# Altium project HVSUP_module_1.5k_rev2.1.PrjPcb (part 1 of 2)
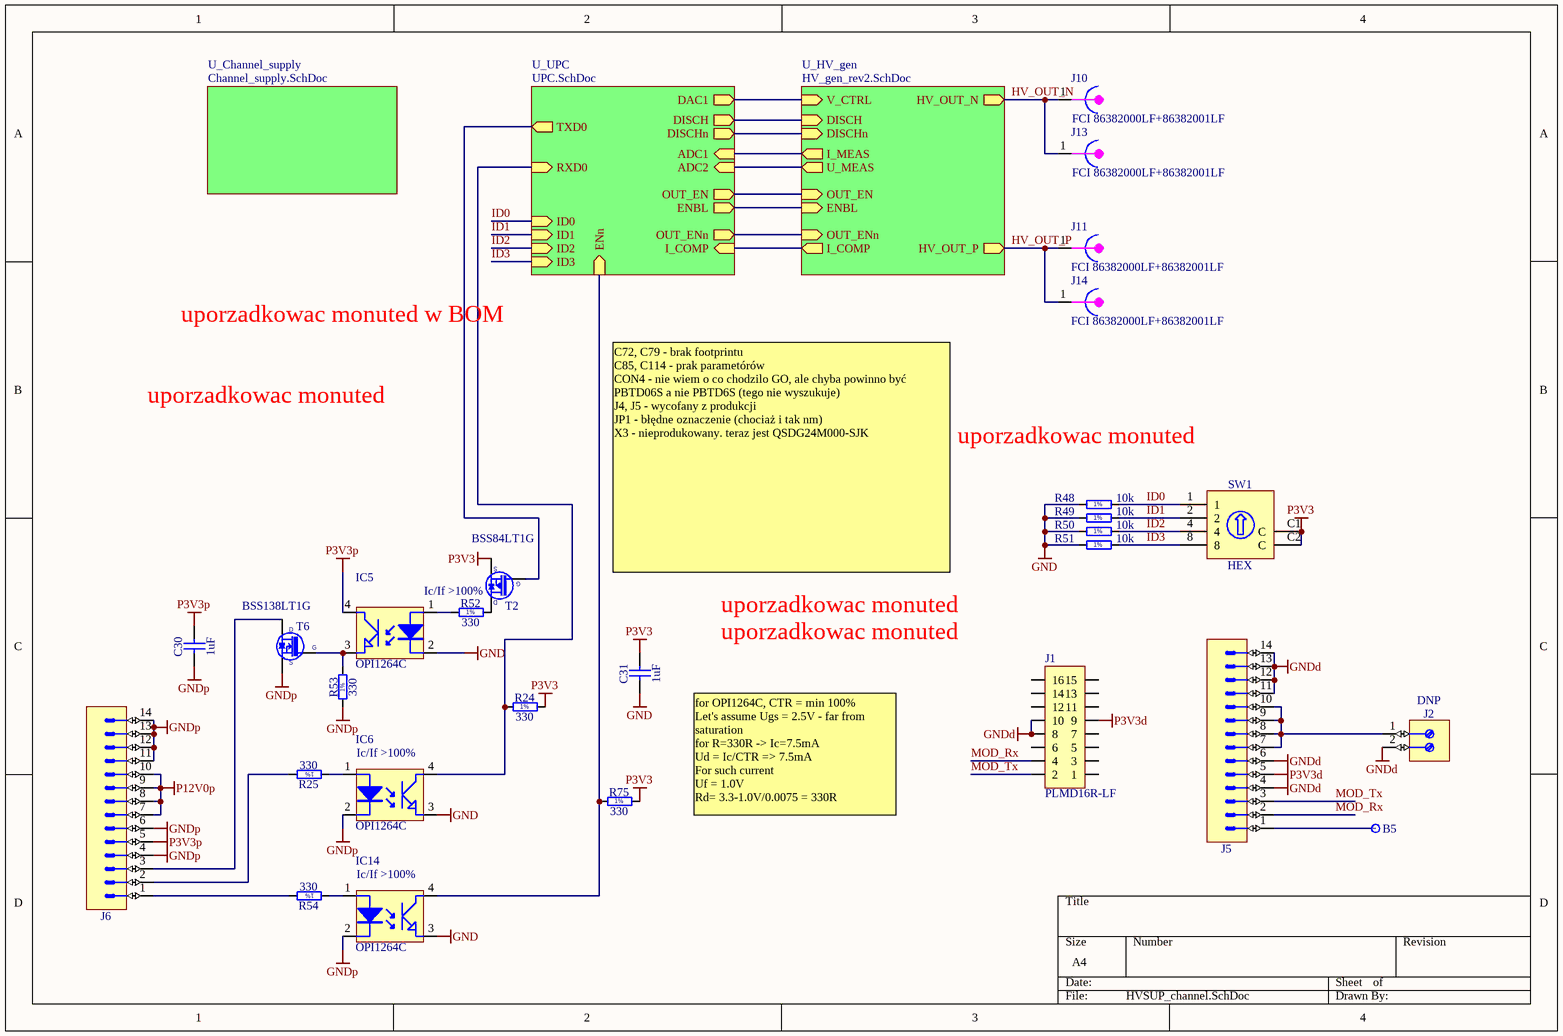
[diagram p0: HVSUP_channel.SchDoc]
4 sheets, 216 parts. Net scope: hierarchical (ports join the sheet entries above them; power ports are global).
Board file: HVSUP_channel_LLC_rev2.1.PcbDoc
Sheets:
  HVSUP_channel.SchDoc
    U_Channel_supply = Channel_supply.SchDoc
    U_UPC = UPC.SchDoc
    U_HV_gen = HV_gen_rev2.SchDoc

## Sheet HVSUP_channel.SchDoc
size A4

### Parts
B5  Plated Hole  [c130h80]  (value not drawn)
C30  1uF  [CAPC1005X55N]
C31  1uF  [CAPC1005X55N]
IC5  OPI1264C  [OPI1264C]
IC6  OPI1264C  [OPI1264C]
IC14  OPI1264C  [OPI1264C]
J1  PLMD16R-LF  [PLMD16R-LF]
J2  DNP  [PHOENIX_1725656]
J5  Header 14  [3M_N2514-5002RB]  (value not drawn)
J6  Header 14  [3M_N2514-5002RB]  (value not drawn)
J10  FCI 86382000LF+86382001LF  [FCI_86382000LF]
J11  FCI 86382000LF+86382001LF  [FCI_86382000LF]
J13  FCI 86382000LF+86382001LF  [FCI_86382000LF]
J14  FCI 86382000LF+86382001LF  [FCI_86382000LF]
R24  330  [RESC1005X40N]
R25  330  [RESC1005X40N]
R48  10k  [RESC1005X40N]
R49  10k  [RESC1005X40N]
R50  10k  [RESC1005X40N]
R51  10k  [RESC1005X40N]
R52  330  [RESC1005X40N]
R53  330  [RESC1005X40N]
R54  330  [RESC1005X40N]
R75  330  [RESC1005X40N]
SW1  HEX  [SW_OMRON_A6RV-162RF]
T2  BSS84LT1G  [SOT95P240X110-3N]
T6  BSS138LT1G  [SOT95P240X110-3N]

### Sub-sheets
U_Channel_supply = Channel_supply.SchDoc: no entries
U_HV_gen = HV_gen_rev2.SchDoc: HV_OUT_P (out), HV_OUT_N (out), ENBL (in), V_CTRL (in), I_MEAS (out), U_MEAS (out), OUT_EN (in), OUT_ENn (in), I_COMP (out), DISCH (in), DISCHn (in)
U_UPC = UPC.SchDoc: ADC1 (in), ADC2 (in), DAC1 (out), TXD0 (out), RXD0 (in), ENBL (out), ID0 (in), ID1 (in), ID2 (in), ID3 (in), OUT_EN (out), ENn (in), OUT_ENn (out), I_COMP (in), DISCH (out), DISCHn (out)

### Nets
GND: C31.1 IC5.2(K) IC6.3(E) IC14.3(E) R48.1 R49.1 R50.1 R51.1
GNDd: J1.8 J1.10 J2.2 J5.4 J5.6 J5.11 J5.12 J5.13 J5.14
GNDp: C30.1 IC6.2(K) IC14.2(K) J6.4 J6.6 J6.11 J6.12 J6.13 J6.14 R53.1 T6.2(S)
P3V3: C31.2 R24.2 R75.2 SW1.C1(C) SW1.C2(C) T2.2(S)
P3V3d: J1.9 J5.5
P3V3p: C30.2 IC5.4(C) J6.5
P12V0p: J6.7 J6.8 J6.9 J6.10
ADC1: sheet U_UPC/ADC1, sheet U_HV_gen/I_MEAS
ADC2: sheet U_UPC/ADC2, sheet U_HV_gen/U_MEAS
DAC1: sheet U_UPC/DAC1, sheet U_HV_gen/V_CTRL
HV_OUT_N: J10.1 J13.1 ; sheet U_HV_gen/HV_OUT_N
HV_OUT_P: J11.1 J14.1 ; sheet U_HV_gen/HV_OUT_P
ID0: R48.2 SW1.1 ; sheet U_UPC/ID0
ID1: R49.2 SW1.2 ; sheet U_UPC/ID1
ID2: R50.2 SW1.4 ; sheet U_UPC/ID2
ID3: R51.2 SW1.8 ; sheet U_UPC/ID3
MOD_Rx: J1.4 J5.2
MOD_Tx: J1.2 J5.3
RXD0: IC6.4(C) R24.1 ; sheet U_UPC/RXD0
TXD0: T2.1(G) ; sheet U_UPC/TXD0
Net1_1: sheet U_UPC/OUT_EN, sheet U_HV_gen/OUT_EN
NetB5_1: B5.1 J5.1
NetC71_1: sheet U_UPC/I_COMP, sheet U_HV_gen/I_COMP
NetIC5_1: IC5.1(A) R52.1
NetIC5_3: IC5.3(E) R53.2 T6.1(G)
NetIC6_1: IC6.1(A) R25.1
NetIC10_2: sheet U_UPC/OUT_ENn, sheet U_HV_gen/OUT_ENn
NetIC14_1: IC14.1(A) R54.1
NetIC14_4: IC14.4(C) R75.1 ; sheet U_UPC/ENn
NetIC15_7: sheet U_UPC/ENBL, sheet U_HV_gen/ENBL
NetIC15_20: sheet U_UPC/DISCH, sheet U_HV_gen/DISCH
NetIC15_21: sheet U_UPC/DISCHn, sheet U_HV_gen/DISCHn
NetJ2_1: J2.1 J5.7 J5.8 J5.9 J5.10
NetJ6_1: J6.1 R54.2
NetJ6_2: J6.2 R25.2
NetJ6_3: J6.3 T6.3(D)
NetR52_2: R52.2 T2.3(D)

Not connected (* = marked no-connect by the designer): J1 1 3 5 6 7 11 12 13 14 15 16

### Notes on the sheet
- uporzadkowac monuted w BOM
- uporzadkowac monuted
- C72, C79 - brak footprintu
  C85, C114 - prak parametórów
  CON4 - nie wiem o co chodzilo GO, ale chyba powinno być PBTD06S a nie PBTD6S (tego nie wyszukuje)
  J4, J5 - wycofany z produkcji
  JP1 - błędne oznaczenie (chociaż i tak nm)
  X3 - nieprodukowany. teraz jest QSDG24M000-SJK
- for OPI1264C, CTR = min 100%
  Let's assume Ugs = 2.5V - far from saturation
  for R=330R -> Ic=7.5mA
  Ud = Ic/CTR => 7.5mA
  For such current
  Uf = 1.0V
  Rd= 3.3-1.0V/0.0075 = 330R
- (in symbol OPTO-OPI1264C) Ic/If >100%
- (in symbol R0402_10K_1%_0.0625W_100PPM) 1%
- (in symbol R0402_330R_1%_0.0625W_100PPM) 1%

### Library data of the parts
B5 = PLATED_HOLE0.8_PAD1.3: Single Terminal Socket; Part Description: Plated Through Hole: Hole Dia.=0.8mm Pad Dia.=1.3mm; Mounted: No; Part Number: PLATED_HOLE0.8_PAD1.3; Component Kind: Standard (No BOM); Component Type: Standard (No BOM); Pin Count: 1; Family: Plated Hole; Socket: No; SMD: No; Sense: No; Status: None; ComponentHeight: 0mm; HelpURL: Undefined; Author: CERN DEM JLC; CreateDate: 2008-10-30; LatestRevisionDate: 2008-10-30; PackageDescription: Plated Through Hole: Hole Dia.=0.8mm Pad Dia.=1.3mm
C30 C31 = CC0402_1UF_16V_10%_X5R: Non-polarised capacitor; Part Description: SMD Multilayer Chip Ceramic Capacitor; Manufacturer: GENERIC; Manufacturer1 Part Number: C1005X5R1C105KT; Voltage: 16V; TC: X5R; Tolerance: ±10%; Part Number: CC0402_1UF_16V_10%_X5R; Component Kind: Standard; Component Type: Standard; Pin Count: 2; Value: 1uF; Status: Preferred; Manufacturer Part Number: CC0402_1UF_16V_10%_X5R; Case: 0402; Mounted: Yes; Socket: No; SMD: Yes; Sense: No; Manufacturer1 Example: TDK; Manufacturer1 ComponentHeight: 0.55mm; HelpURL: \\cern.ch\dfs\Applications\Altium\Datasheets\CC0402_X5R_TDK_C.pdf; Author: CERN DEM JLC; CreateDate: 2012-10-25; LatestRevisionDate: 2012-10-25
IC5 IC6 IC14 = OPTO-OPI1264C: 10kV opto-coupler; Supplier 1: Newark; Supplier Part Number 1: 08F2863
J1 = CON_2x8 2mm_RA_male: 2mm  dual row goldpin (Maritex)
J2 = PHOENIX_1725656: Terminal Block, 2 Positions, Screw Connection; Part Description: 6A, 63V, Terminal Block, Pitch 2.54mm, 2 Positions, Screw Connection; Manufacturer: PHOENIX CONTACT; Manufacturer Part Number: 1725656 (MPT 0,5/2-2,54); PressFit: No; Part Number: PHOENIX_1725656; Component Kind: Standard; Component Type: Standard; Pin Count: 2; Mounted: Yes; Socket: No; SMD: No; Sense: No; Status: None; ComponentHeight: 8.5mm; HelpURL: \\cern.ch\dfs\Applications\Altium\Datasheets\PHOENIX_1725656.pdf; Author: CERN DEM JMW; CreateDate: 2008-11-07; LatestRevisionDate: 2010-04-26
J5 J6 = 3M_N2514-5002RB: Connector 14 Male; Part Description: 14 Contacts - Right Angle .100" x .100" Low Profile Four-Wall Header, 2500 Series; Manufacturer: 3M; PressFit: No; Part Number: 3M_N2514-5002RB; Component Kind: Standard; Component Type: Standard; Pin Count: 14; Family: Header 14; Mounted: Yes; Socket: No; SMD: No; Sense: No; Status: None; Manufacturer Part Number: N2514-5002RB; ComponentHeight: 8.59mm; HelpURL: \\cern.ch\dfs\Applications\Altium\Datasheets\3M_N2514-5002RB.pdf; Author: CERN DEM JLC; CreateDate: 2008-10-29; LatestRevisionDate: 2012-01-16
J10 J11 J13 J14 = CON_HV_DSUB_PIN: D-SUB HIGH VOLTAGE CONTACT PIN
R24 R25 R52-R54 R75 = R0402_330R_1%_0.0625W_100PPM: Resistor - 1%; Part Description: General Purpose Thick Film Chip Resistor; Manufacturer: GENERIC; Manufacturer1 Part Number: 232270673301L; TC: ±100ppm/°C; Part Number: R0402_330R_1%_0.0625W_100PPM; Component Kind: Standard; Component Type: Standard; Pin Count: 2; Value: 330; Status: Not recommended; Power: 0.0625W; Tolerance: ±1%; Manufacturer Part Number: R0402_330R_1%_0.0625W_100PPM; Case: 0402; Mounted: Yes; Sense: No; Socket: No; SMD: Yes; Manufacturer1 Example: YAGEO PHYCOMP; Manufacturer1 ComponentHeight: 0.4mm; HelpURL: \\cern.ch\dfs\Applications\Altium\Datasheets\R0402_Phycomp_RC0402.pdf; Author: CERN DEM JLC; CreateDate: 2007-12-03; LatestRevisionDate: 2012-10-17
R48-R51 = R0402_10K_1%_0.0625W_100PPM: Resistor - 1%; Part Description: General Purpose Thick Film Chip Resistor; Manufacturer: GENERIC; Manufacturer1 Part Number: 232270671003L; TC: ±100ppm/°C; Part Number: R0402_10K_1%_0.0625W_100PPM; Component Kind: Standard; Component Type: Standard; Pin Count: 2; Value: 10k; Status: Not recommended; Power: 0.0625W; Tolerance: ±1%; Manufacturer Part Number: R0402_10K_1%_0.0625W_100PPM; Case: 0402; Mounted: Yes; Sense: No; Socket: No; SMD: Yes; Manufacturer1 Example: YAGEO PHYCOMP; Manufacturer1 ComponentHeight: 0.4mm; HelpURL: \\cern.ch\dfs\Applications\Altium\Datasheets\R0402_Phycomp_RC0402.pdf; Author: CERN DEM JLC; CreateDate: 2007-12-03; LatestRevisionDate: 2012-10-17
SW1 = SW_OMRON_A6RV-162RF: Rotary Code Switch 1 2 4 8 C1 C2; Part Number: SW_OMRON_A6RV-162RF or ERD716RR; Part Description: Side Actuated, Hexadecimal Rotary Code Switch; Manufacturer: OMRON; Manufacturer Part Number: A6RV-162RF or ERD716RR; PressFit: No; Component Kind: Standard; Component Type: Standard; Pin Count: 6; PackageDescription: Body 9.8x6.64mm, Side Actuated, Rotary Code Switch, OMRON A6RV Series; Family: HEX; Mounted: Yes; Socket: No; SMD: No; Sense: No; Status: None; ComponentHeight: 9.9mm; HelpURL: \\cern.ch\dfs\Applications\Altium\Datasheets\SW_OMRON_A6RV.pdf; Author: CERN DEM JLC; CreateDate: 2008-11-27; LatestRevisionDate: 2011-01-19
T2 = BSS84LT1G: P-CHANNEL MOSFET WITH DIODE; Part Description: 50V 130mA Single P-Channel Power MOSFET; Manufacturer: ON SEMICONDUCTOR; PressFit: No; Bonding: No; Part Number: BSS84LT1G; Component Kind: Standard; Component Type: Standard; Device: BSS84LT1G; PackageDescription: SOT23 3-Leads, Pitch 0.95mm - Body 1.4x3mm, IPC Medium Density; Manufacturer Part Number: BSS84LT1G; Pin Count: 3; Case: SOT23-3; Mounted: Yes; Socket: No; SMD: Yes; Sense: No; ComponentHeight: 1.1mm; HelpURL: \\cern.ch\dfs\Applications\Altium\Datasheets\BSS84LT1G.pdf; Author: CERN DEM JLC; CreateDate: 2012-03-29; LatestRevisionDate: 2012-03-29
T6 = BSS138LT1G: N-CHANNEL MOSFET WITH DIODE; Part Description: 50V 200mA N-Channel Enhancement Mode Field-Effect Transistor; Manufacturer: ON SEMICONDUCTOR; PressFit: No; Bonding: No; Part Number: BSS138LT1G; Component Kind: Standard; Component Type: Standard; Device: BSS138LT1G; PackageDescription: SOT23 3-Leads, Pitch 0.95mm - Body 1.4x3mm, IPC Medium Density; Manufacturer Part Number: BSS138LT1G; Pin Count: 3; Case: SOT23-3; Mounted: Yes; Socket: No; SMD: Yes; Sense: No; ComponentHeight: 1.11mm; HelpURL: \\cern.ch\dfs\Applications\Altium\Datasheets\BSS138LT1G.pdf; Author: CERN DEM JLC; CreateDate: 2009-03-23; LatestRevisionDate: 2009-03-23

## Sheet Channel_supply.SchDoc
size A3
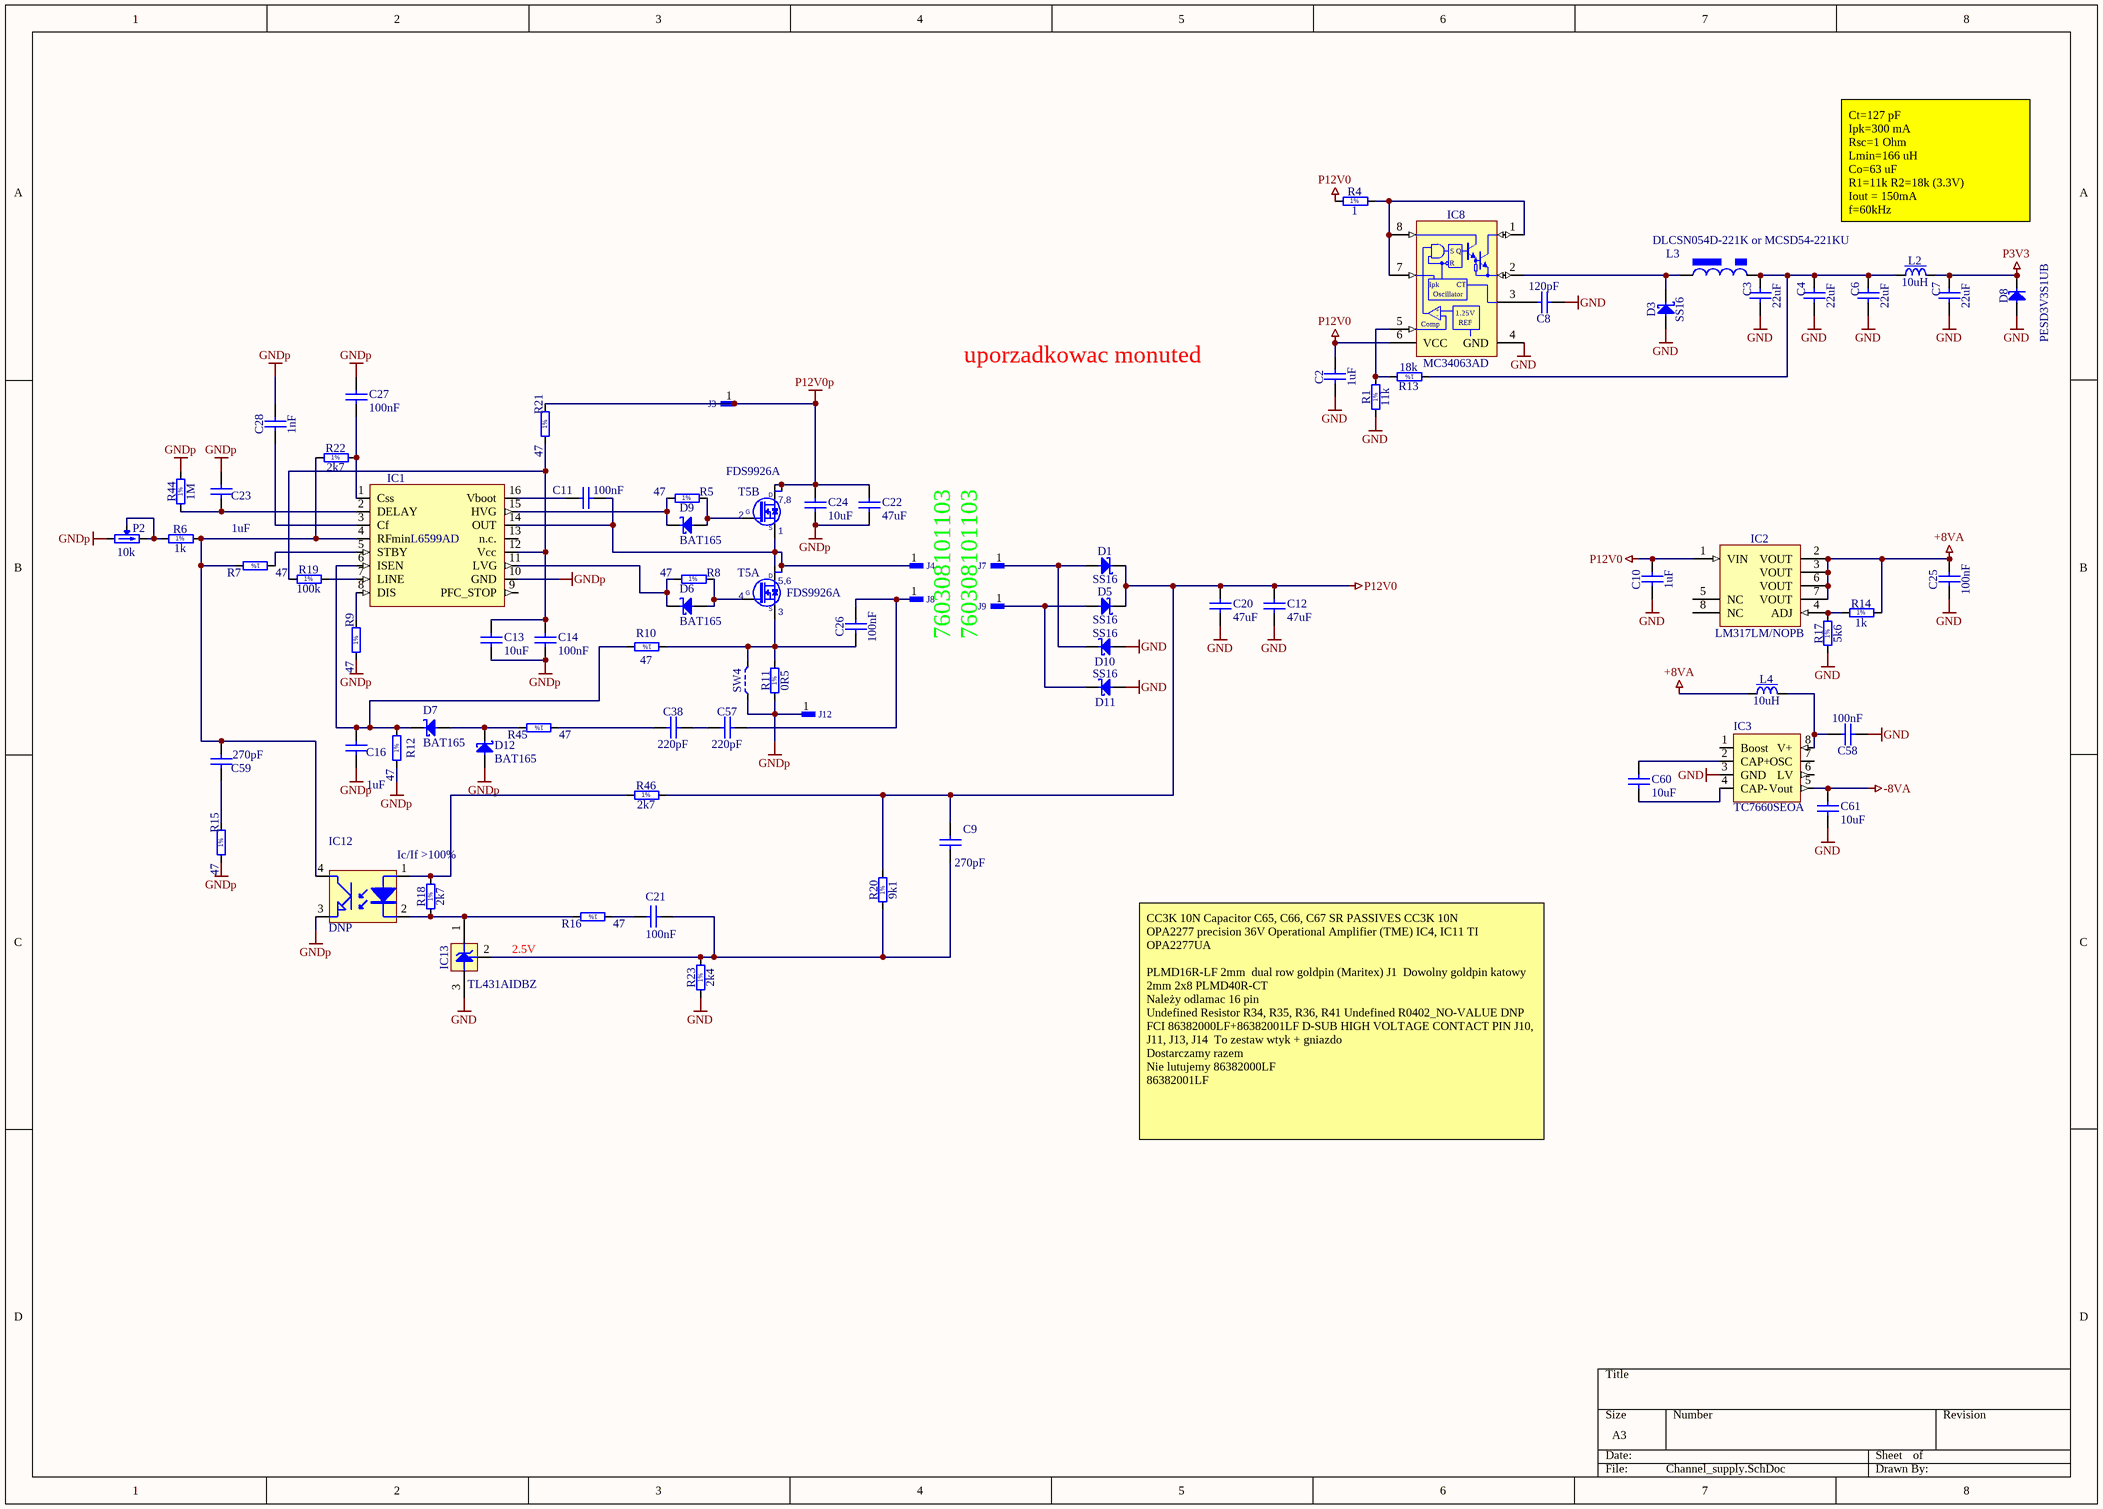
[diagram p1: Channel_supply.SchDoc]

### Parts
C2  1uF  [CAPC1608X87N]
C3  22uF  [CAPC2012X135N]
C4  22uF  [CAPC2012X135N]
C6  22uF  [CAPC2012X135N]
C7  22uF  [CAPC2012X135N]
C8  120pF  [CAPC1005X55N]
C9  270pF  [CAPC1608X87N]
C10  1uF  [CAPC1608X87N]
C11  100nF  [CAPC1005X55N]
C12  47uF  [CAPC3216X180N]
C13  10uF  [CAPC3216X180N]
C14  100nF  [CAPC1005X55N]
C16  1uF  [CAPC1608X87N]
C20  47uF  [CAPC3216X180N]
C21  100nF  [CAPC1005X55N]
C22  47uF  [CAPC3216X180N]
C23  1uF  [CAPC1608X87N]
C24  10uF  [CAPC3216X180N]
C25  100nF  [CAPC1005X55N]
C26  100nF  [CAPC4532X250N]
C27  100nF  [CAPC1005X55N]
C28  1nF  [CAPC1608X90N]
C38  220pF  [CAPC3216X140N]
C57  220pF  [CAPC3216X140N]
C58  100nF  [CAPC1005X55N]
C59  270pF  [CAPC1608X87N]
C60  10uF  [CAPC3216X180N]
C61  10uF  [CAPC3216X180N]
D1  SS16  [DIOM5127X229N]
D3  SS16  [DIOM5127X229N]
D5  SS16  [DIOM5127X229N]
D6  BAT165  [SOD2512X110N]
D7  BAT165  [SOD2512X110N]
D8  PESD3V3S1UB  [SODFL1608X65N]
D9  BAT165  [SOD2512X110N]
D10  SS16  [DIOM5127X229N]
D11  SS16  [DIOM5127X229N]
D12  BAT165  [SOD2512X110N]
IC1  L6599AD  [SOIC127P600X175-16N]
IC2  LM317LM/NOPB  [SOIC127P600X175-8N]
IC3  TC7660SEOA  [SO-8]
IC8  MC34063AD  [SOIC127P600X175-8N]
IC12  DNP  [OPI1264C]
IC13  TL431AIDBZ  [SOT95P237X112-3N]
J3  SMD Pad  [R400X300]  (value not drawn)  (no BOM)
J4  SMD Pad  [R400X300]  (value not drawn)  (no BOM)
J7  SMD Pad  [R400X300]  (value not drawn)  (no BOM)
J8  SMD Pad  [R400X300]  (value not drawn)  (no BOM)
J9  SMD Pad  [R400X300]  (value not drawn)  (no BOM)
J12  SMD Pad  [R400X300]  (value not drawn)  (no BOM)
L2  10uH  [INDM3225X210N]
L3  DLCSN054D-221K or MCSD54-221KU  [L_CSN054D]
L4  10uH  [INDM3225X210N]
P2  10k  [TRIM_BOURNS_3314G-1]
R1  11k  [RESC1005X40N]
R4  1  [RESC1608X55N]
R5  47  [RESC1608X55N]
R6  1k  [RESC1005X40N]
R7  47  [RESC1608X55N]
R8  47  [RESC1608X55N]
R9  47  [RESC1608X55N]
R10  47  [RESC1608X55N]
R11  0R5  [RESC6532X80N]
R12  47  [RESC1608X55N]
R13  18k  [RESC1005X40N]
R14  1k  [RESC1005X40N]
R15  47  [RESC1608X55N]
R16  47  [RESC1608X55N]
R17  5k6  [RESC1005X40N]
R18  2k7  [RESC1608X55N]
R19  100k  [RESC1005X40N]
R20  9k1  [RESC1608X55N]
R21  47  [RESC1608X55N]
R22  2k7  [RESC1608X55N]
R23  2k4  [RESC1608X55N]
R44  1M  [RESC1608X55N]
R45  47  [RESC1608X55N]
R46  2k7  [RESC1608X55N]
SW4  Switch  [JUMPSMD0805_G50]  (value not drawn)  (no BOM)
T5  FDS9926A  [SOIC127P600X175-8N]  (parts A,B of 2)

### Nets
+8VA: C25.2 IC2.2(VOUT) IC2.3(VOUT) IC2.6(VOUT) IC2.7(VOUT) L4.1 R14.2
-8VA: C61.1 IC3.5(Vout)
GND: C2.1 C3.1 C4.1 C6.1 C7.1 C8.1 C10.1 C12.2 C20.2 C25.1 C58.1 C61.2 D3.2(A) D8.2(A) D10.2(A) D11.2(A) IC3.3(GND) IC8.4(GND) IC13.3(A) R1.1 R17.1 R23.1
GNDp: C13.2 C14.2 C16.1 C22.2 C23.2 C24.2 C27.1 C28.2 D12.2(A) IC1.10(GND) IC12.3(E) J12.1 P2.1(CCW) R9.1 R11.1 R12.1 R15.1 R44.2 SW4.1
P3V3: C7.2 D8.1(C) L2.2
P12V0: C2.2 C9.2 C10.2 C12.1 C20.1 D1.1(C) D5.1(C) IC2.1(VIN) IC8.6(VCC) R4.1 R20.2 R46.2
P12V0p: C22.1 C24.1 J3.1 R21.2 T5.7(D) T5.8(D)
NetC3_2: C3.2 C4.2 C6.2 L2.1 L3.2 R13.1
NetC8_2: C8.2 IC8.3(TC)
NetC9_1: C9.1 C21.1 IC13.2(Adj) R20.1 R23.2
NetC11_1: C11.1 IC1.16(Vboot)
NetC11_2: C11.2 IC1.14(OUT) J4.1 T5.1(S) T5.5(D) T5.6(D)
NetC13_1: C13.1 C14.1 IC1.12(Vcc) R19.1 R21.1
NetC16_2: C16.2 D7.1(C) IC1.6(ISEN) R10.2 R12.2
NetC21_2: C21.2 R16.1
NetC23_1: C23.1 IC1.2(DELAY) R44.1
NetC26_1: C26.1 R10.1 R11.2 SW4.2 T5.3(S)
NetC26_2: C26.2 C57.2 J8.1
NetC27_2: C27.2 IC1.1(Css) R22.2
NetC28_1: C28.1 IC1.3(Cf)
NetC38_1: C38.1 R45.1
NetC38_2: C38.2 C57.1
NetC58_2: C58.2 IC3.8(V+) L4.2
NetC59_1: C59.1 R15.2
NetC59_2: C59.2 IC1.4(RFmin) IC12.4(C) R6.2 R7.2 R22.1
NetC60_1: C60.1 IC3.2(CAP+)
NetC60_2: C60.2 IC3.4(CAP-)
NetD1_2: D1.2(A) D10.1(C) J7.1
NetD3_1: D3.1(C) IC8.2(SWE) L3.1
NetD5_2: D5.2(A) D11.1(C) J9.1
NetD6_1: D6.1(C) IC1.11(LVG) R8.1
NetD6_2: D6.2(A) R8.2 T5.4(G)
NetD7_2: D7.2(A) D12.1(C) R45.2
NetD9_1: D9.1(C) IC1.15(HVG) R5.1
NetD9_2: D9.2(A) R5.2 T5.2(G)
NetIC1_5: IC1.5(STBY) R7.1
NetIC1_7: IC1.7(LINE) R19.2
NetIC1_8: IC1.8(DIS) R9.2
NetIC2_4: IC2.4(ADJ) R14.1 R17.2
NetIC8_1: IC8.1(SWC) IC8.7(Ipk) IC8.8(DRVC) R4.2
NetIC8_5: IC8.5(COMP) R1.2 R13.2
NetIC12_1: IC12.1(A) R18.2 R46.1
NetIC12_2: IC12.2(K) IC13.1(C) R16.2 R18.1
NetP2_2: P2.2(W) P2.3(CW) R6.1

Not connected (* = marked no-connect by the designer): IC1 9(PFC_STOP) 13(n.c.); IC2 5(NC) 8(NC); IC3 1(Boost) 6(LV) 7(OSC)

### Notes on the sheet
- Ct=127 pF
  Ipk=300 mA
  Rsc=1 Ohm
  Lmin=166 uH
  Co=63 uF
  R1=11k R2=18k (3.3V)
  Iout = 150mA
  f=60kHz
- uporzadkowac monuted
- 760308101103
- 2.5V
- CC3K 10N	Capacitor	C65, C66, C67	SR PASSIVES	CC3K 10N
  OPA2277	precision 36V Operational Amplifier (TME)	IC4, IC11	TI	OPA2277UA
  PLMD16R-LF	2mm  dual row goldpin (Maritex)	J1		Dowolny goldpin katowy 2mm 2x8	PLMD40R-CT
  Należy odlamac 16 pin
  Undefined	Resistor	R34, R35, R36, R41	Undefined	R0402_NO-VALUE	DNP
  FCI 86382000LF+86382001LF	D-SUB HIGH VOLTAGE CONTACT PIN	J10, J11, J13, J14		To zestaw wtyk + gniazdo
  Dostarczamy razem
  Nie lutujemy	86382000LF
  86382001LF
- (in symbol FDS9926A, part A) 5,6
- (in symbol FDS9926A, part B) 7,8
- (in symbol MC34063AD) S; Q; R; CT; Oscillator; +; -; 1.25V; Comp; REF
- (in symbol OPTO-OPI1264C) Ic/If >100%
- (in symbol R0402_1K_1%_0.0625W_100PPM) 1%
- (in symbol R0402_5K6_1%_0.0625W_100PPM) 1%
- (in symbol R0402_11K_1%_0.0625W_100PPM) 1%
- (in symbol R0402_18K_1%_0.0625W_100PPM) 1%
- (in symbol R0402_100K_1%_0.0625W_100PPM) 1%
- (in symbol R0603_1M_1%_0.1W_100PPM) 1%
- (in symbol R0603_1R_1%_0.1W_200PPM) 1%
- (in symbol R0603_2K4_1%_0.1W_100PPM) 1%
- (in symbol R0603_2K7_1%_0.1W_100PPM) 1%
- (in symbol R0603_9K1_1%_0.1W_100PPM) 1%
- (in symbol R0603_47R_1%_0.1W_100PPM) 1%
- (in symbol R2512_0R5_1%_1.5W_100PPM) 1%

### Library data of the parts
C2 C10 C16 C23 = CC0603_1UF_25V_10%_X7R: Non-polarised capacitor; Part Description: SMD Multilayer Chip Ceramic Capacitor; Manufacturer: GENERIC; Manufacturer1 Part Number: GRM188R71E105KA12D; Voltage: 25V; TC: X7R; Tolerance: ±10%; Part Number: CC0603_1UF_25V_10%_X7R; Component Kind: Standard; Component Type: Standard; Pin Count: 2; Value: 1uF; Status: None; Manufacturer Part Number: CC0603_1UF_25V_10%_X7R; Case: 0603; Mounted: Yes; Socket: No; SMD: Yes; Sense: No; Manufacturer1 Example: MURATA; Manufacturer1 ComponentHeight: 0.9mm; HelpURL: \\cern.ch\dfs\Applications\Altium\Datasheets\CC0603_X7R_MURATA.pdf; Author: CERN DEM JLC; CreateDate: 2011-01-18; LatestRevisionDate: 2011-01-18
C3 C4 C6 C7 = CC0805_22UF_10V_+80%-20%_Y5V: Non-polarised capacitor; Part Description: SMD Multilayer Chip Ceramic Capacitor; Manufacturer: GENERIC; Manufacturer1 Part Number: 2222 241 19881; Voltage: 10V; TC: Y5V; Part Number: CC0805_22UF_10V_+80%-20%_Y5V; Component Kind: Standard; Component Type: Standard; Pin Count: 2; Value: 22uF; Status: Preferred; Tolerance: +80% -20%; Manufacturer Part Number: CC0805_22UF_10V_+80%-20%_Y5V; Case: 0805; Mounted: Yes; Socket: No; SMD: Yes; Sense: No; Manufacturer1 Example: PHYCOMP; Manufacturer1 ComponentHeight: 1.45mm; HelpURL: \\cern.ch\dfs\Applications\Altium\Datasheets\CC0805_Y5V_PHYCOMP.pdf; Author: CERN DEM JLC; CreateDate: 2007-12-03; LatestRevisionDate: 2007-12-03
C8 = CC0402_120PF_50V_5%_C0G: Non-polarised capacitor; Part Description: SMD Multilayer Chip Ceramic Capacitor; Manufacturer: GENERIC; Manufacturer1 Part Number: C0402C121J5GACTU; Voltage: 50V; TC: C0G/NP0; Tolerance: ±5%; Part Number: CC0402_120PF_50V_5%_C0G; Component Kind: Standard; Component Type: Standard; Pin Count: 2; Value: 120pF; Status: Preferred; Manufacturer Part Number: CC0402_120PF_50V_5%_C0G; Case: 0402; Mounted: Yes; Socket: No; SMD: Yes; Sense: No; Manufacturer1 Example: KEMET; Manufacturer1 ComponentHeight: 0.55mm; HelpURL: \\cern.ch\dfs\Applications\Altium\Datasheets\CC0805_C0G_KEMET_(Commercial Grade).pdf; Author: CERN DEM JLC; CreateDate: 2011-11-10; LatestRevisionDate: 2015-04-22
C9 C59 = CC0603_270PF_50V_5%_NP0: Non-polarised capacitor; Part Description: SMD Multilayer Chip Ceramic Capacitor; Manufacturer: GENERIC; Manufacturer1 Part Number: 223886715271; Voltage: 50V; TC: C0G/NP0; Tolerance: ±5%; Part Number: CC0603_270PF_50V_5%_NP0; Component Kind: Standard; Component Type: Standard; Pin Count: 2; Value: 270pF; Status: Preferred; Manufacturer Part Number: CC0603_270PF_50V_5%_NP0; Case: 0603; Mounted: Yes; Socket: No; SMD: Yes; Sense: No; Manufacturer1 Example: PHYCOMP; Manufacturer1 ComponentHeight: 0.87mm; HelpURL: \\cern.ch\dfs\Applications\Altium\Datasheets\CC0603_NP0_PHYCOMP.pdf; Author: CERN DEM JLC; CreateDate: 2007-12-03; LatestRevisionDate: 2007-12-03
C11 C14 C21 C27 = CC0402_100NF_16V_10%_X7R: Non-polarised capacitor; Part Description: SMD Multilayer Chip Ceramic Capacitor; Manufacturer: GENERIC; Manufacturer1 Part Number: GRM155R71C104KA88D; Voltage: 16V; TC: X7R; Tolerance: ±10%; Table: Capacitors SMD; Part Number: CC0402_100NF_16V_10%_X7R; Component Kind: Standard; Component Type: Standard; Pin Count: 2; Value: 100nF; Status: Not Recommended; Manufacturer Part Number: CC0402_100NF_16V_10%_X7R; Case: 0402; Mounted: Yes; Socket: No; SMD: Yes; Manufacturer1 Example: MURATA; Manufacturer1 ComponentHeight: 0.55mm; HelpURL: \\cern.ch\dfs\Applications\Altium\Datasheets\CC0402_X7R_MURATA_GRM.pdf; Author: CERN DEM JLC; CreateDate: 2013-12-05; LatestRevisionDate: 2007-12-03
C12 C20 C22 = CC1206_47UF_25V_20%_X5R: Non-polarised capacitor; Part Description: SMD Multilayer Chip Ceramic Capacitor; Manufacturer: TDK; Manufacturer Part Number: C3216X5R1E476M160AC; Voltage: 25V; TC: X5R; Tolerance: ±20%; Table: Capacitors SMD; Part Number: CC1206_47UF_25V_20%_X5R; Component Kind: Standard; Component Type: Standard; Pin Count: 2; Value: 47uF; Status: None; Case: 1206; Mounted: Yes; Socket: No; SMD: Yes; HelpURL: \\cern.ch\dfs\Applications\Altium\Datasheets\CC1206_X5R_TDK_C.pdf; Author: CERN DEM JLC; CreateDate: 2013-11-20; LatestRevisionDate: 2013-11-20; ComponentHeight: 1.8mm
C13 C24 C60 C61 = CC1206_10UF_25V_10%_X7R: Non-polarised capacitor; Part Description: SMD Multilayer Chip Ceramic Capacitor; Manufacturer: GENERIC; Manufacturer1 Part Number: C1206C106K4RACTU; Voltage: 25V; TC: X7R; Tolerance: ±10%; Table: Capacitors SMD; Part Number: CC1206_10UF_25V_10%_X7R; Component Kind: Standard; Component Type: Standard; Pin Count: 2; Value: 10uF; Status: Preferred; Manufacturer Part Number: CC1206_10uF_25V_10%_X7R; Case: 1206; Mounted: Yes; Socket: No; SMD: Yes; Manufacturer1 Example: KEMET; Manufacturer1 ComponentHeight: 1.8mm; HelpURL: \\cern.ch\dfs\Applications\Altium\Datasheets\CC1206_X7R_KEMET.pdf; Author: CERN DEM JLC; CreateDate: 2012-09-12; LatestRevisionDate: 2012-09-12
C25 C58 = CC0402_100NF_16V_10%_X7R: Non-polarised capacitor; Part Description: SMD Multilayer Chip Ceramic Capacitor; Manufacturer: GENERIC; Manufacturer1 Part Number: GRM155R71C104KA88D; Voltage: 16V; TC: X7R; Tolerance: ±10%; Part Number: CC0402_100NF_16V_10%_X7R; Component Kind: Standard; Component Type: Standard; Pin Count: 2; Value: 100nF; Status: Not Recommended; Manufacturer Part Number: CC0402_100NF_16V_10%_X7R; Case: 0402; Mounted: Yes; Socket: No; SMD: Yes; Sense: No; Manufacturer1 Example: MURATA; Manufacturer1 ComponentHeight: 0.55mm; HelpURL: \\cern.ch\dfs\Applications\Altium\Datasheets\CC0402_X7R_MURATA_GRM.pdf; Author: CERN DEM JLC; CreateDate: 2013-12-05; LatestRevisionDate: 2007-12-03
C26 = CC1812_100NF_500V_10%_X7R: Non-polarised capacitor; Part Description: SMD Multilayer Chip Ceramic Capacitor; Manufacturer: GENERIC; Manufacturer1 Part Number: 1812Y5000104KXB; Voltage: 500V; TC: X7R; Tolerance: ±10%; Part Number: CC1812_100NF_500V_10%_X7R; Component Kind: Standard; Component Type: Standard; Pin Count: 2; Value: 100nF; Status: None; Manufacturer Part Number: CC1812_100NF_500V_10%_X7R; Case: 1812; Mounted: Yes; Socket: No; SMD: Yes; Sense: No; Manufacturer1 Example: SYFER; Manufacturer1 ComponentHeight: 2.5mm; HelpURL: \\cern.ch\dfs\Applications\Altium\Datasheets\CC1812_X7R_SYFER.pdf; Author: CERN DEM JMW; CreateDate: 2009-01-23; LatestRevisionDate: 2011-06-07
C28 = CC0603_1NF_50V_5%_NP0: Non-polarised capacitor; Part Description: SMD Multilayer Chip Ceramic Capacitor; Manufacturer: GENERIC; Manufacturer1 Part Number: CC0603JRNPO9BN102; Voltage: 50V; TC: C0G/NP0; Tolerance: ±5%; Part Number: CC0603_1NF_50V_5%_NP0; Component Kind: Standard; Component Type: Standard; Pin Count: 2; Value: 1nF; Status: Preferred; Manufacturer Part Number: CC0603_1NF_50V_5%_NP0; Case: 0603; Mounted: Yes; Socket: No; SMD: Yes; Sense: No; Manufacturer1 Example: YAGEO PHYCOMP; Manufacturer1 ComponentHeight: 0.9mm; HelpURL: \\cern.ch\dfs\Applications\Altium\Datasheets\CC0805_NP0_PHYCOMP_16VTO50V.pdf; Author: CERN DEM JLC; CreateDate: 22.10.2012; LatestRevisionDate: 22.10.2012
C38 C57 = CC1206_220PF_100V_5%_NP0: Non-polarised capacitor; Part Description: SMD Multilayer Chip Ceramic Capacitor; Manufacturer: GENERIC; Manufacturer1 Part Number: 12061A221JAT2A; Voltage: 100V; TC: C0G/NP0; Tolerance: ±5%; Part Number: CC1206_220PF_100V_5%_NP0; Component Kind: Standard; Component Type: Standard; Pin Count: 2; Value: 220pF; Status: Preferred; Manufacturer Part Number: CC1206_220PF_100V_5%_NP0; Case: 1206; Mounted: Yes; Socket: No; SMD: Yes; Sense: No; Manufacturer1 Example: AVX; Manufacturer1 ComponentHeight: 0.94mm; HelpURL: \\cern.ch\dfs\Applications\Altium\Datasheets\CC1206_NP0_AVX.pdf; Author: CERN DEM JLC; CreateDate: 06.04.2011; LatestRevisionDate: 06.04.2011
D1 D3 D5 D10 D11 = SS16: Schottky Diode; Part Description: Surface Mount Schottky Barrier Rectifier; Manufacturer: VISHAY GENERAL SEMICONDUCTOR; Voltage: 60V; Power: 1A; PressFit: No; Bonding: No; Part Number: SS16; Component Kind: Standard; Component Type: Standard; Device: SS16; PackageDescription: DO-214-AC Molded Diode, Body 5.1x2.7mm, IPC Medium Density; Manufacturer Part Number: SS16; Pin Count: 2; Case: DO-214AC; Mounted: Yes; Socket: No; SMD: Yes; Sense: No; ComponentHeight: 2.29mm; HelpURL: \\cern.ch\dfs\Applications\Altium\Datasheets\SS16.pdf; Author: CERN DEM JLC; CreateDate: 2008-07-15; LatestRevisionDate: 2010-08-23
D6 D7 D9 D12 = BAT165: Schottky Diode; Part Description: Medium Power AF Schottky Diode; Manufacturer: INFINEON; Voltage: 40V; Power: 750mA; Mounted: No; PressFit: No; Bonding: No; Table: Diodes; Part Number: BAT165; Component Kind: Standard; Component Type: Standard; Device: BAT165; PackageDescription: Small Outline Diode Flat Lead (SOD-323), 1.70mm W X 1.25mm L X 1.10mm H body,  IPC Medium Density; Manufacturer Part Number: BAT165; Pin Count: 2; Case: SOD323; Socket: No; SMD: Yes; ComponentHeight: 1.1mm; HelpURL: \\cern.ch\dfs\Applications\Altium\Datasheets\BAT165.pdf; Author: CERN DEM JLC; CreateDate: 2014-11-12; LatestRevisionDate: 2014-11-12
D8 = PESD3V3S1UB: ESD protection diode; Part Description: ESD protection diode (23kV); Manufacturer: NXP SEMICONDUCTORS; Voltage: 3V3; Power: 330W; PressFit: No; Bonding: No; Part Number: PESD3V3S1UB; Component Kind: Standard; Component Type: Standard; Device: PESD3V3S1UB; PackageDescription: Ultra Small Outline Diode Flat Lead (SOD-523), Body; 1.2mm L X 0.8mm W X 0.65mm H, IPC Medium Density; Manufacturer Part Number: PESD3V3S1UB; Pin Count: 2; Case: SOD523; Mounted: Yes; Socket: No; SMD: Yes; Sense: No; ComponentHeight: 0.65mm; HelpURL: \\cern.ch\dfs\Applications\Altium\Datasheets\PESD3V3S1UB.pdf; Author: CERN DEM JLC; CreateDate: 2012-11-29; LatestRevisionDate: 2012-11-29
IC1 = PM_L6599: Improved high voltage resonant LLC controller; Part Description: Improved high voltage resonant controller; Manufacturer: ST MICROELECTRONICS; PressFit: No; Bonding: No; Part Number: L6599AD; Component Kind: Standard; Component Type: Standard; Device: L6599AD; PackageDescription: SOIC 16, Pitch 1.27mm - Body 4x10mm, IPC Medium Density; Manufacturer Part Number: L6599AD; Pin Count: 16; Case: SO-16; Mounted: Yes; Socket: No; SMD: Yes; Sense: No; ComponentHeight: 1.75mm; Author: GK; CreateDate: 2016-05-23; LatestRevisionDate: 2016-05-23
IC2 = LM317LM/NOPB: 1.2V to 37V, 100mA Adjustable Positive Regulator; Part Description: 1.2V to 37V, 100mA Adjustable Positive Voltage Regulator; Manufacturer: TEXAS INSTRUMENTS; PressFit: No; Bonding: No; Part Number: LM317LM/NOPB; Component Kind: Standard; Component Type: Standard; Device: LM317LM/NOPB; PackageDescription: SOIC 8, Pitch 1.27mm - Body 4x5mm, IPC Medium Density; Manufacturer Part Number: LM317LM/NOPB; Pin Count: 8; Case: SOIC8; Mounted: Yes; Socket: No; SMD: Yes; Sense: No; ComponentHeight: 1.75mm; HelpURL: \\cern.ch\dfs\Applications\Altium\Datasheets\LM317LM-NOPB.pdf; Author: CERN DEM JLC; CreateDate: 2012-04-12; LatestRevisionDate: 2014-09-16
IC3 = PM_TC7660: 20mA PUMP DC-TO-DC VOLTAGE CONVERTER
IC8 = MC34063AD: 3V to 40V 1.5A Peak Boost/Buck/Inverting Switching Regulator; Manufacturer: TEXAS INSTRUMENTS; PressFit: No; Bonding: No; Part Number: MC34063AD; Component Kind: Standard; Component Type: Standard; Device: MC34063AD; PackageDescription: SOIC 8, Pitch 1.27mm - Body 4x5mm, IPC Medium Density; Part Description: 3V to 40V 1.5A Peak Boost/Buck/Inverting Switching Regulator; Manufacturer Part Number: MC34063AD; Pin Count: 8; Case: SOIC8; Mounted: Yes; Socket: No; SMD: Yes; Sense: No; ComponentHeight: 1.75mm; HelpURL: \\cern.ch\dfs\Applications\Altium\Datasheets\MC34063AD.pdf; Author: CERN DEM JLC; CreateDate: 2009-10-27; LatestRevisionDate: 2009-10-27
IC12 = OPTO-OPI1264C: 10kV opto-coupler; Supplier 1: Newark; Supplier Part Number 1: 08F2863
IC13 = TL431AIDBZ: Precision Reference 1=Cathode 2=Adj 3=Anode; Part Description: Vref (2.495V) To 36V 1% Precision Programmable Reference; Manufacturer: TEXAS INSTRUMENTS; PressFit: No; Bonding: No; Part Number: TL431AIDBZ; Component Kind: Standard; Component Type: Standard; Device: TL431AIDBZ; PackageDescription: SOT, 0.95mm, Pitch; 3 Pin,1.30mm W X 2.92mm L X 1.12mm H Body, IPC Medium Density; Manufacturer Part Number: TL431AIDBZ; Pin Count: 3; Case: SOT-23; Mounted: Yes; Socket: No; SMD: Yes; Sense: No; ComponentHeight: 1.12mm; HelpURL: \\cern.ch\dfs\Applications\Altium\Datasheets\TL431AIDBZ.pdf; Author: CERN DEM JMW; CreateDate: 2015-10-22; LatestRevisionDate: 2015-10-22
J3 J4 J7-J9 J12 = SMD_PAD_4X3MM: Single SMD Pad; Part Description: 4mm x 3mm SMD Pad; Mounted: No; Part Number: SMD_PAD_4X3MM; Component Type: Standard (No BOM); Pin Count: 1; Family: SMD Pad; Socket: No; SMD: No; Sense: No; Status: None; ComponentHeight: 0mm; HelpURL: Undefined; Author: CERN DEM JLC; CreateDate: 2010-03-15; LatestRevisionDate: 2010-03-15; PackageDescription: 4mm x  3mm SMD Pad
L2 L4 = IND1210_10UH_10%_EPCOS_B82422A: Inductor With Core; Part Description: SMT Inductor SIMID Series; Manufacturer: EPCOS; Manufacturer Part Number: B82422A1103K100; Power: 180mA; Resistance: 1.60R; Tolerance: ±10%; Part Number: IND1210_10UH_10%_EPCOS_B82422A; Component Kind: Standard; Component Type: Standard; Pin Count: 2; Value: 10uH; Status: None; Case: 1210; Mounted: Yes; Socket: No; SMD: Yes; Sense: No; ComponentHeight: 2.1mm; HelpURL: \\cern.ch\dfs\Applications\Altium\Datasheets\IND1210_EPCOS_B82422A.pdf; Author: CERN DEM BC; CreateDate: 2015-11-18; LatestRevisionDate: 2015-11-18
L3 = L_POWER_DLCSN054D_220uH: 220uH, 0.35A, 1.57R, inductor (Maritex); Supplier 1: Newark; Supplier Part Number 1: 75R0143
P2 = TRIM_1T_10K_BOURNS_3314G-1-103E: Trimming Potentiometer; Part Description: Single Turn 4mm Square Trimpot® Trimming Potentiometer (Top Adjust); Manufacturer: BOURNS; Power: 0.25W; TC: ±100ppm/°C; Tolerance: ±20%; Part Number: TRIM_1T_10K_BOURNS_3314G-1-103E; Component Kind: Standard; Component Type: Standard; Pin Count: 3; Value: 10k; Manufacturer Part Number: 3314G-1-103E; Case: 3314G-1; Mounted: Yes; Socket: No; SMD: Yes; Sense: No; ComponentHeight: 2.55mm; HelpURL: \\cern.ch\dfs\Applications\Altium\Datasheets\TRIM_BOURNS_3314G-1.pdf; Author: CERN DEM JLC; CreateDate: 2014-03-04; LatestRevisionDate: 2014-03-04
R1 = R0402_11K_1%_0.0625W_100PPM: Resistor - 1%; Part Description: General Purpose Thick Film Chip Resistor; Manufacturer: GENERIC; Manufacturer1 Part Number: 232270671103L; TC: ±100ppm/°C; Part Number: R0402_11K_1%_0.0625W_100PPM; Component Kind: Standard; Component Type: Standard; Pin Count: 2; Value: 11k; Status: Not recommended; Power: 0.0625W; Tolerance: ±1%; Manufacturer Part Number: R0402_11K_1%_0.0625W_100PPM; Case: 0402; Mounted: Yes; Sense: No; Socket: No; SMD: Yes; Manufacturer1 Example: YAGEO PHYCOMP; Manufacturer1 ComponentHeight: 0.4mm; HelpURL: \\cern.ch\dfs\Applications\Altium\Datasheets\R0402_Phycomp_RC0402.pdf; Author: CERN DEM JLC; CreateDate: 2007-12-03; LatestRevisionDate: 2012-10-17
R4 = R0603_1R_1%_0.1W_200PPM: Resistor - 1%; Part Description: General Purpose Thick Film Chip Resistor; Manufacturer: GENERIC; Manufacturer1 Part Number: 232270461008L or RC0603FR-071RL; Power: 0.1W; TC: ±200ppm/°C; Part Number: R0603_1R_1%_0.1W_200PPM; Component Kind: Standard; Component Type: Standard; Pin Count: 2; Value: 1; Status: Preferred; Tolerance: ±1%; Manufacturer Part Number: R0603_1R_1%_0.1W_200PPM; Case: 0603; Mounted: Yes; Sense: No; Socket: No; SMD: Yes; Manufacturer1 Example: YAGEO PHYCOMP; Manufacturer1 ComponentHeight: 0.65mm; HelpURL: \\cern.ch\dfs\Applications\Altium\Datasheets\R0603_Phycomp_RC0603.pdf; Author: CERN DEM JLC; CreateDate: 2007-12-03; LatestRevisionDate: 2012-10-17
R5 R7-R10 R12 R15 R16 R21 R45 = R0603_47R_1%_0.1W_100PPM: Resistor - 1%; Part Description: General Purpose Thick Film Chip Resistor; Manufacturer: GENERIC; Manufacturer1 Part Number: NRC06F47R0TRF; Power: 0.1W; TC: ±100ppm/°C; Part Number: R0603_47R_1%_0.1W_100PPM; Component Kind: Standard; Component Type: Standard; Pin Count: 2; Value: 47; Status: Preferred; Tolerance: ±1%; Manufacturer Part Number: R0603_47R_1%_0.1W_100PPM; Case: 0603; Mounted: Yes; Sense: No; Socket: No; SMD: Yes; Manufacturer1 Example: NIC COMPONENT; Manufacturer1 ComponentHeight: 0.55mm; HelpURL: \\cern.ch\dfs\Applications\Altium\Datasheets\R0603_NIC_NRC.pdf; Author: CERN DEM JLC; CreateDate: 2007-12-03; LatestRevisionDate: 2008-03-13
R6 R14 = R0402_1K_1%_0.0625W_100PPM: Resistor - 1%; Part Description: General Purpose Thick Film Chip Resistor; Manufacturer: GENERIC; Manufacturer1 Part Number: 232270671002L; TC: ±100ppm/°C; Part Number: R0402_1K_1%_0.0625W_100PPM; Component Kind: Standard; Component Type: Standard; Pin Count: 2; Value: 1k; Status: Not recommended; Power: 0.0625W; Tolerance: ±1%; Manufacturer Part Number: R0402_1K_1%_0.0625W_100PPM; Case: 0402; Mounted: Yes; Sense: No; Socket: No; SMD: Yes; Manufacturer1 Example: YAGEO PHYCOMP; Manufacturer1 ComponentHeight: 0.4mm; HelpURL: \\cern.ch\dfs\Applications\Altium\Datasheets\R0402_Phycomp_RC0402.pdf; Author: CERN DEM JLC; CreateDate: 2007-12-03; LatestRevisionDate: 2012-10-17
R11 = R2512_0R5_1%_1.5W_100PPM: Resistor - 1%; Part Description: Thick Film Chip Resistor; Manufacturer: GENERIC; Manufacturer1 Part Number: LR2512-R50FW; Power: 1.5W; TC: ±100ppm/°C; Part Number: R2512_0R5_1%_1.5W_100PPM; Component Kind: Standard; Component Type: Standard; Pin Count: 2; Value: 0R5; Status: None; Tolerance: ±1%; Manufacturer Part Number: R2512_0R5_1%_1.5W_100PPM; Case: 2512; Mounted: Yes; Sense: No; Socket: No; SMD: Yes; Manufacturer1 Example: WELWYN; Manufacturer1 ComponentHeight: 0.8mm; HelpURL: \\cern.ch\dfs\Applications\Altium\Datasheets\R2512_WELWYN_LR.pdf; Author: CERN DEM JLC; CreateDate: 2010-08-23; LatestRevisionDate: 2010-08-23
R13 = R0402_18K_1%_0.0625W_100PPM: Resistor - 1%; Part Description: General Purpose Thick Film Chip Resistor; Manufacturer: GENERIC; Manufacturer1 Part Number: 232270671803L; TC: ±100ppm/°C; Part Number: R0402_18K_1%_0.0625W_100PPM; Component Kind: Standard; Component Type: Standard; Pin Count: 2; Value: 18k; Status: Not recommended; Power: 0.0625W; Tolerance: ±1%; Manufacturer Part Number: R0402_18K_1%_0.0625W_100PPM; Case: 0402; Mounted: Yes; Sense: No; Socket: No; SMD: Yes; Manufacturer1 Example: YAGEO PHYCOMP; Manufacturer1 ComponentHeight: 0.4mm; HelpURL: \\cern.ch\dfs\Applications\Altium\Datasheets\R0402_Phycomp_RC0402.pdf; Author: CERN DEM JLC; CreateDate: 2007-12-03; LatestRevisionDate: 2012-10-17
R17 = R0402_5K6_1%_0.0625W_100PPM: Resistor - 1%; Part Description: General Purpose Thick Film Chip Resistor; Manufacturer: GENERIC; Manufacturer1 Part Number: 232270675602L; TC: ±100ppm/°C; Part Number: R0402_5K6_1%_0.0625W_100PPM; Component Kind: Standard; Component Type: Standard; Pin Count: 2; Value: 5k6; Status: Not recommended; Power: 0.0625W; Tolerance: ±1%; Manufacturer Part Number: R0402_5K6_1%_0.0625W_100PPM; Case: 0402; Mounted: Yes; Sense: No; Socket: No; SMD: Yes; Manufacturer1 Example: YAGEO PHYCOMP; Manufacturer1 ComponentHeight: 0.4mm; HelpURL: \\cern.ch\dfs\Applications\Altium\Datasheets\R0402_Phycomp_RC0402.pdf; Author: CERN DEM JLC; CreateDate: 2007-12-03; LatestRevisionDate: 2012-10-17
R18 R22 R46 = R0603_2K7_1%_0.1W_100PPM: Resistor - 1%; Part Description: General Purpose Thick Film Chip Resistor; Manufacturer: GENERIC; Manufacturer1 Part Number: RC0603FR-072K7L; Power: 0.1W; TC: ±100ppm/°C; Part Number: R0603_2K7_1%_0.1W_100PPM; Component Kind: Standard; Component Type: Standard; Pin Count: 2; Value: 2k7; Status: Preferred; Tolerance: ±1%; Manufacturer Part Number: R0603_2K7_1%_0.1W_100PPM; Case: 0603; Mounted: Yes; Sense: No; Socket: No; SMD: Yes; Manufacturer1 Example: YAGEO PHYCOMP; Manufacturer1 ComponentHeight: 0.55mm; HelpURL: \\cern.ch\dfs\Applications\Altium\Datasheets\R0603_PHYCOMP_RC0603.pdf; Author: CERN DEM JLC; CreateDate: 2011-05-02; LatestRevisionDate: 2011-05-02
R19 = R0402_100K_1%_0.0625W_100PPM: Resistor - 1%; Part Description: General Purpose Thick Film Chip Resistor; Manufacturer: GENERIC; Manufacturer1 Part Number: 232270671004L; TC: ±100ppm/°C; Part Number: R0402_100K_1%_0.0625W_100PPM; Component Kind: Standard; Component Type: Standard; Pin Count: 2; Value: 100k; Status: Not recommended; Power: 0.0625W; Tolerance: ±1%; Manufacturer Part Number: R0402_100K_1%_0.0625W_100PPM; Case: 0402; Mounted: Yes; Sense: No; Socket: No; SMD: Yes; Manufacturer1 Example: YAGEO PHYCOMP; Manufacturer1 ComponentHeight: 0.4mm; HelpURL: \\cern.ch\dfs\Applications\Altium\Datasheets\R0402_Phycomp_RC0402.pdf; Author: CERN DEM JLC; CreateDate: 2007-12-03; LatestRevisionDate: 2012-10-17
R20 = R0603_9K1_1%_0.1W_100PPM: Resistor - 1%; Part Description: General Purpose Thick Film Chip Resistor; Manufacturer: GENERIC; Manufacturer1 Part Number: NRC06F9101TRF; Power: 0.1W; TC: ±100ppm/°C; Part Number: R0603_9K1_1%_0.1W_100PPM; Component Kind: Standard; Component Type: Standard; Pin Count: 2; Value: 9k1; Status: Preferred; Tolerance: ±1%; Manufacturer Part Number: R0603_9K1_1%_0.1W_100PPM; Case: 0603; Mounted: Yes; Sense: No; Socket: No; SMD: Yes; Manufacturer1 Example: NIC COMPONENT; Manufacturer1 ComponentHeight: 0.55mm; HelpURL: \\cern.ch\dfs\Applications\Altium\Datasheets\R0603_NIC_NRC.pdf; Author: CERN DEM JLC; CreateDate: 2007-12-03; LatestRevisionDate: 2008-03-13
R23 = R0603_2K4_1%_0.1W_100PPM: Resistor - 1%; Part Description: General Purpose Thick Film Chip Resistor; Manufacturer: GENERIC; Manufacturer1 Part Number: NRC06F2401TRF; Power: 0.1W; TC: ±100ppm/°C; Part Number: R0603_2K4_1%_0.1W_100PPM; Component Kind: Standard; Component Type: Standard; Pin Count: 2; Value: 2k4; Status: Preferred; Tolerance: ±1%; Manufacturer Part Number: R0603_2K4_1%_0.1W_100PPM; Case: 0603; Mounted: Yes; Sense: No; Socket: No; SMD: Yes; Manufacturer1 Example: NIC COMPONENT; Manufacturer1 ComponentHeight: 0.55mm; HelpURL: \\cern.ch\dfs\Applications\Altium\Datasheets\R0603_NIC_NRC.pdf; Author: CERN DEM JLC; CreateDate: 2007-12-03; LatestRevisionDate: 2008-03-13
R44 = R0603_1M_1%_0.1W_100PPM: Resistor - 1%; Part Description: General Purpose Thick Film Chip Resistor; Manufacturer: GENERIC; Manufacturer1 Part Number: NRC06F1004TRF; Power: 0.1W; TC: ±100ppm/°C; Part Number: R0603_1M_1%_0.1W_100PPM; Component Kind: Standard; Component Type: Standard; Pin Count: 2; Value: 1M; Status: Preferred; Tolerance: ±1%; Manufacturer Part Number: R0603_1M_1%_0.1W_100PPM; Case: 0603; Mounted: Yes; Sense: No; Socket: No; SMD: Yes; Manufacturer1 Example: NIC COMPONENT; Manufacturer1 ComponentHeight: 0.55mm; HelpURL: \\cern.ch\dfs\Applications\Altium\Datasheets\R0603_NIC_NRC.pdf; Author: CERN DEM JLC; CreateDate: 2007-12-03; LatestRevisionDate: 2008-03-13
SW4 = JUMPSMD0805_G50: 2 SMD Pads for Bound by Solder  Drop; Part Description: 2 SMD Pads for Bound by Solder Drop - Equivalent Size 0805 - Gap 0.5mm; Manufacturer: None; Mounted: No; PressFit: No; Part Number: JUMPSMD0805_G50; Component Type: Standard (No BOM); Pin Count: 2; PackageDescription: 2 SMD Pads for Bound by Solder Drop - Equivalent Size 0805 - Gap 0.5mm; Family: Switch; Socket: No; SMD: Yes; Sense: No; Status: None; Manufacturer Part Number: None; ComponentHeight: 0mm; HelpURL: None; Author: CERN DEM JLC; CreateDate: 2009-08-26; LatestRevisionDate: 2009-09-09
T5 = FDS9926A: 20V DUAL N-Channel 2.5V Specified PowerTrench MOSFET; Part Description: 20V DUAL N-Channel 2.5V Specified PowerTrench® MOSFET; Manufacturer: FAIRCHILD SEMICONDUCTOR; PressFit: No; Bonding: No; Part Number: FDS9926A; Component Kind: Standard; Component Type: Standard; Device: FDS9926A; PackageDescription: SOIC 8, Pitch 1.27mm - Body 4x5mm, IPC Medium Density; Manufacturer Part Number: FDS9926A; Pin Count: 8; Case: SOIC8; Mounted: Yes; Socket: No; SMD: Yes; Sense: No; ComponentHeight: 1.75mm; HelpURL: \\cern.ch\dfs\Applications\Altium\Datasheets\FDS9926A.pdf; Author: CERN DEM BC; CreateDate: 2015-09-02; LatestRevisionDate: 2015-09-02

## Sheet UPC.SchDoc
size A4
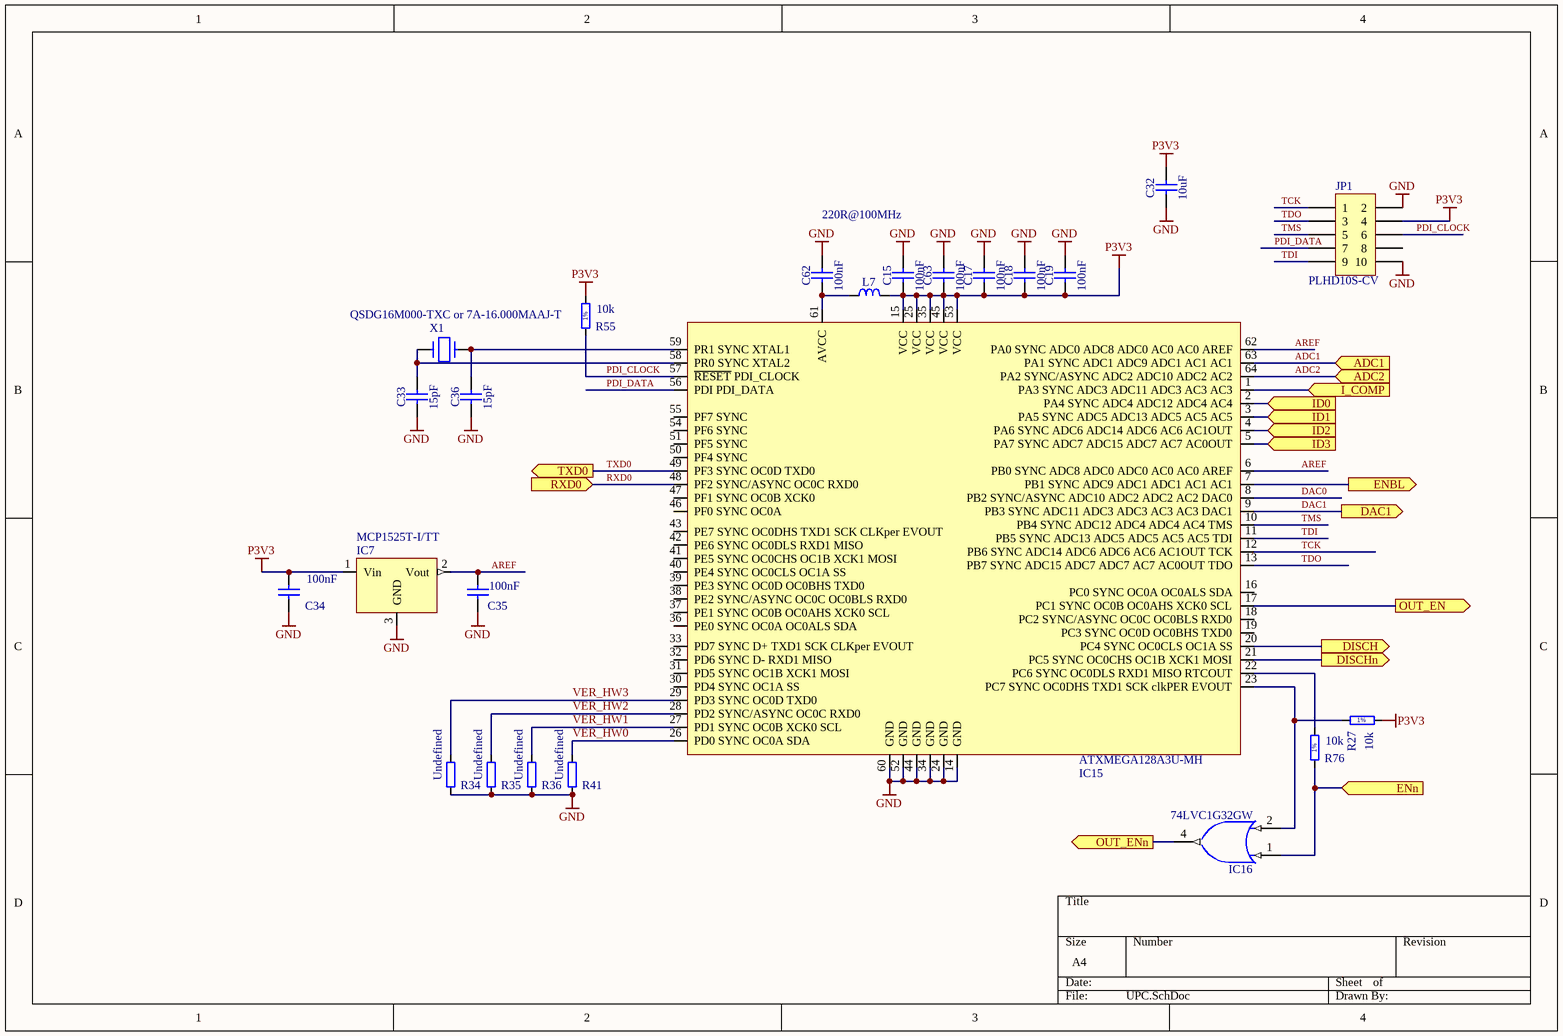
[diagram p2: UPC.SchDoc]

### Parts
C15  100nF  [CAPC1005X55N]
C17  100nF  [CAPC1005X55N]
C18  100nF  [CAPC1005X55N]
C19  100nF  [CAPC1005X55N]
C32  10uF  [CAPC2012X135N]
C33  15pF  [CAPC1005X55N]
C34  100nF  [CAPC1005X55N]
C35  100nF  [CAPC1005X55N]
C36  15pF  [CAPC1005X55N]
C62  100nF  [CAPC1005X55N]
C63  100nF  [CAPC1005X55N]
IC7  MCP1525T-I/TT  [SOT95P251X112-3N]
IC15  ATXMEGA128A3U-MH  [QFN64]
IC16  74LVC1G32GW  [SOT65P212X110-5N]
JP1  PLHD10S-CV  [CON_2x5_MINI]
L7  220R@100MHz  [INDC1005X55N]
R27  10k  [RESC1005X40N]
R34  Undefined  [RESC1005X40N]
R35  Undefined  [RESC1005X40N]
R36  Undefined  [RESC1005X40N]
R41  Undefined  [RESC1005X40N]
R55  10k  [RESC1005X40N]
R76  10k  [RESC1005X40N]
X1  QSDG16M000-TXC or 7A-16.000MAAJ-T  [XTAL_5.0*3.2]

### Ports
ADC1 (in), ADC2 (in), DAC1 (out), DISCH (out), DISCHn (out), ENBL (out), ENn (in), I_COMP (in), ID0 (in), ID1 (in), ID2 (in), ID3 (in), OUT_EN (out), OUT_ENn (out), RXD0 (in), TXD0 (out)

### Nets
GND: C15.2 C17.2 C18.2 C19.2 C32.1 C33.1 C34.1 C35.1 C36.1 C62.2 C63.2 IC7.3(GND) IC15.14(GND) IC15.24(GND) IC15.34(GND) IC15.44(GND) IC15.52(GND) IC15.60(GND) IC16.3(GND) JP1.2 JP1.10 R34.1 R35.1 R36.1 R41.1
P3V3: C15.1 C17.1 C18.1 C19.1 C32.2 C34.2 C63.1 IC7.1(Vin) IC15.15(VCC) IC15.25(VCC) IC15.35(VCC) IC15.45(VCC) IC15.53(VCC) IC16.5(VCC) JP1.4 L7.2 R27.2 R55.2
ADC1: IC15.63(PA1_SYNC_ADC1_ADC9_ADC1_AC1_AC1) ; port ADC1
ADC2: IC15.64(PA2_SYNC/ASYNC_ADC2_ADC10_ADC2_AC2) ; port ADC2
AREF: C35.2 IC7.2(Vout) IC15.6(PB0_SYNC_ADC8_ADC0_ADC0_AC0_AC0_AREF) IC15.62(PA0_SYNC_ADC0_ADC8_ADC0_AC0_AC0_AREF)
DAC0: IC15.8(PB2_SYNC/ASYNC_ADC10_ADC2_ADC2_AC2_DAC0)
DAC1: IC15.9(PB3_SYNC_ADC11_ADC3_ADC3_AC3_AC3_DAC1) ; port DAC1
ID0: IC15.2(PA4_SYNC_ADC4_ADC12_ADC4_AC4) ; port ID0
ID1: IC15.3(PA5_SYNC_ADC5_ADC13_ADC5_AC5_AC5) ; port ID1
ID2: IC15.4(PA6_SYNC_ADC6_ADC14_ADC6_AC6_AC1OUT) ; port ID2
ID3: IC15.5(PA7_SYNC_ADC7_ADC15_ADC7_AC7_AC0OUT) ; port ID3
PDI_CLOCK: IC15.57(~{RESET}_PDI_CLOCK) JP1.6 R55.1
PDI_DATA: IC15.56(PDI_PDI_DATA) JP1.7
RXD0: IC15.48(PF2_SYNC/ASYNC_OC0C_RXD0) ; port RXD0
TCK: IC15.12(PB6_SYNC_ADC14_ADC6_ADC6_AC6_AC1OUT_TCK) JP1.1
TDI: IC15.11(PB5_SYNC_ADC13_ADC5_ADC5_AC5_AC5_TDI) JP1.9
TDO: IC15.13(PB7_SYNC_ADC15_ADC7_ADC7_AC7_AC0OUT_TDO) JP1.3
TMS: IC15.10(PB4_SYNC_ADC12_ADC4_ADC4_AC4_TMS) JP1.5
TXD0: IC15.49(PF3_SYNC_OC0D_TXD0) ; port TXD0
VER_HW0: IC15.26(PD0_SYNC_OC0A_SDA) R41.2
VER_HW1: IC15.27(PD1_SYNC_OC0B_XCK0_SCL) R36.2
VER_HW2: IC15.28(PD2_SYNC/ASYNC_OC0C_RXD0) R35.2
VER_HW3: IC15.29(PD3_SYNC_OC0D_TXD0) R34.2
Net1_1: IC15.17(PC1_SYNC_OC0B_OC0AHS_XCK0_SCL) ; port OUT_EN
NetC33_2: C33.2 IC15.58(PR0_SYNC_XTAL2) X1.2
NetC36_2: C36.2 IC15.59(PR1_SYNC_XTAL1) X1.1
NetC62_1: C62.1 IC15.61(AVCC) L7.1
NetC71_1: IC15.1(PA3_SYNC_ADC3_ADC11_ADC3_AC3_AC3) ; port I_COMP
NetIC10_2: IC16.4(Y) ; port OUT_ENn
NetIC14_4: IC16.1(A) R76.1 ; port ENn
NetIC15_7: IC15.7(PB1_SYNC_ADC9_ADC1_ADC1_AC1_AC1) ; port ENBL
NetIC15_20: IC15.20(PC4_SYNC_OC0CLS_OC1A_SS) ; port DISCH
NetIC15_21: IC15.21(PC5_SYNC_OC0CHS_OC1B_XCK1_MOSI) ; port DISCHn
NetIC15_22: IC15.22(PC6_SYNC_OC0DLS_RXD1_MISO_RTCOUT) R76.2
NetIC15_23: IC15.23(PC7_SYNC_OC0DHS_TXD1_SCK_clkPER_EVOUT) IC16.2(B) R27.1

Not connected (* = marked no-connect by the designer): IC15 16(PC0_SYNC_OC0A_OC0ALS_SDA) 18(PC2_SYNC/ASYNC_OC0C_OC0BLS_RXD0) 19(PC3_SYNC_OC0D_OC0BHS_TXD0) 30(PD4_SYNC_OC1A_SS) 31(PD5_SYNC_OC1B_XCK1_MOSI) 32(PD6_SYNC_D-_RXD1_MISO) 33(PD7_SYNC_D+_TXD1_SCK_CLKper_EVOUT) 36(PE0_SYNC_OC0A_OC0ALS_SDA) 37(PE1_SYNC_OC0B_OC0AHS_XCK0_SCL) 38(PE2_SYNC/ASYNC_OC0C_OC0BLS_RXD0) 39(PE3_SYNC_OC0D_OC0BHS_TXD0) 40(PE4_SYNC_OC0CLS_OC1A_SS) 41(PE5_SYNC_OC0CHS_OC1B_XCK1_MOSI) 42(PE6_SYNC_OC0DLS_RXD1_MISO) 43(PE7_SYNC_OC0DHS_TXD1_SCK_CLKper_EVOUT) 46(PF0_SYNC_OC0A) 47(PF1_SYNC_OC0B_XCK0) 50(PF4_SYNC) 51(PF5_SYNC) 54(PF6_SYNC) 55(PF7_SYNC); JP1 8

### Notes on the sheet
- (in symbol R0402_10K_1%_0.0625W_100PPM) 1%

### Library data of the parts
C15 C17-C19 C34 C35 C62 C63 = CC0402_100NF_16V_10%_X7R: as C25 on sheet Channel_supply; Part Number: CC0402_100NF_16V_10%_X7R; Component Kind: Standard; Component Type: Standard; Pin Count: 2; Value: 100nF; Status: Not Recommended; Manufacturer Part Number: CC0402_100NF_16V_10%_X7R; Case: 0402; Mounted: Yes; Socket: No; SMD: Yes; Sense: No; Manufacturer1 Example: MURATA; Manufacturer1 ComponentHeight: 0.55mm; HelpURL: \\cern.ch\dfs\Applications\Altium\Datasheets\CC0402_X7R_MURATA_GRM.pdf; Author: CERN DEM JLC; CreateDate: 2013-12-05; LatestRevisionDate: 2007-12-03
C32 = CC0805_10UF_16V_10%_X5R: Non-polarised capacitor; Part Description: SMD Multilayer Chip Ceramic Capacitor; Manufacturer: GENERIC; Manufacturer1 Part Number: C0805C106K4PAC; Voltage: 16V; TC: X5R; Tolerance: ±10%; Part Number: CC0805_10UF_16V_10%_X5R; Component Kind: Standard; Component Type: Standard; Pin Count: 2; Value: 10uF; Status: Preferred; Manufacturer Part Number: CC0805_10UF_16V_10%_X5R; Case: 0805; Mounted: Yes; Socket: No; SMD: Yes; Sense: No; Manufacturer1 Example: KEMET; Manufacturer1 ComponentHeight: 1.4mm; HelpURL: \\cern.ch\dfs\Applications\Altium\Datasheets\CC1206_X5R_KEMET.pdf; Author: CERN DEM JLC; CreateDate: 2007-12-03; LatestRevisionDate: 2007-12-03
C33 C36 = CC0402_15PF_50V_5%_C0G: Non-polarised capacitor; Part Description: SMD Multilayer Chip Ceramic Capacitor; Manufacturer: GENERIC; Manufacturer1 Part Number: C0402C150J5GACTU; Voltage: 50V; TC: C0G/NP0; Tolerance: ±5%; Part Number: CC0402_15PF_50V_5%_C0G; Component Kind: Standard; Component Type: Standard; Pin Count: 2; Value: 15pF; Status: Preferred; Manufacturer Part Number: CC0402_15PF_50V_5%_C0G; Case: 0402; Mounted: Yes; Socket: No; SMD: Yes; Sense: No; Manufacturer1 Example: KEMET; Manufacturer1 ComponentHeight: 0.55mm; HelpURL: \\cern.ch\dfs\Applications\Altium\Datasheets\CC0805_C0G_KEMET_(Commercial Grade).pdf; Author: CERN DEM JLC; CreateDate: 2007-12-03; LatestRevisionDate: 2015-04-22
IC7 = REF_MCP1525: 2.5 voltage reference
IC15 = ATXMEGA128: 8/16-bit Atmel  XMEGA A3U  Microcontroller
IC16 = 74LVC1G32GW: Single 2-Input Positive-OR Gate; Part Description: Single 2-input OR gate; Manufacturer: NXP SEMICONDUCTORS; PressFit: No; Bonding: No; Part Number: 74LVC1G32GW; Component Kind: Standard; Component Type: Standard; Device: 74LVC1G32GW; PackageDescription: SOT353, SOT, 0.65mm Pitch, 5 pin, 1.25mm W X 2.05mm L X 1.10mm H, IPC Medium Density; Manufacturer Part Number: 74LVC1G32GW; Pin Count: 5; Case: SOT353; Mounted: Yes; Socket: No; SMD: Yes; Sense: No; ComponentHeight: 1.1mm; Author: CERN DEM JLC; HelpURL: \\cern.ch\dfs\Applications\Altium\Datasheets\74LVC1G32GW.pdf; CreateDate: 2013-11-25; LatestRevisionDate: 2013-11-25
JP1 = CON_2x5 1.27 male: Goldpin 1.27mm
L7 = IND0402_MURATA_BLM15HB221SN1: Inductor; Part Description: SMD EMIFIL Suppression Chip Ferrite Bead; Manufacturer: MURATA; Power: 250mA; Resistance: 1R; Tolerance: ±25%; Part Number: IND0402_MURATA_BLM15HB221SN1; Component Kind: Standard; Component Type: Standard; Pin Count: 2; Value: 220R@100MHz; Status: None; Manufacturer Part Number: BLM15HB221SN1; Case: 0402; Mounted: Yes; Socket: No; SMD: Yes; Sense: No; ComponentHeight: 0.55mm; HelpURL: \\cern.ch\dfs\Applications\Altium\Datasheets\IND0402_MURATA_BLM15H.pdf; Author: CERN DEM JLC; CreateDate: 2009-06-23; LatestRevisionDate: 2009-06-23
R27 R55 R76 = R0402_10K_1%_0.0625W_100PPM: as R48 on sheet HVSUP_channel; Part Number: R0402_10K_1%_0.0625W_100PPM; Component Kind: Standard; Component Type: Standard; Pin Count: 2; Value: 10k; Status: Not recommended; Power: 0.0625W; Tolerance: ±1%; Manufacturer Part Number: R0402_10K_1%_0.0625W_100PPM; Case: 0402; Mounted: Yes; Sense: No; Socket: No; SMD: Yes; Manufacturer1 Example: YAGEO PHYCOMP; Manufacturer1 ComponentHeight: 0.4mm; HelpURL: \\cern.ch\dfs\Applications\Altium\Datasheets\R0402_Phycomp_RC0402.pdf; Author: CERN DEM JLC; CreateDate: 2007-12-03; LatestRevisionDate: 2012-10-17
R34-R36 R41 = R0402_NO-VALUE: Resistor; Part Description: Reserved Footprint For a 0402 (1005) Chip Resistor; Mounted: No; Part Number: R0402_NO-VALUE; Component Kind: Standard; Component Type: Standard; Pin Count: 2; Value: Undefined; Status: None; Manufacturer: Undefined; Manufacturer Part Number: R0402_NO-VALUE; Case: 0402; Sense: No; Socket: No; SMD: Yes; Manufacturer1 Example: Undefined; Manufacturer1 Part Number: Undefined; Manufacturer1 ComponentHeight: Undefined; HelpURL: Undefined; Author: CERN DEM JLC; CreateDate: 2007-12-03; LatestRevisionDate: 2008-03-13
X1 = X_CRYSTAL_SMD_5.0*3.2_16M: miniature crystal oscillator (Maritex); Supplier 1: Digi-Key; Supplier Part Number 1: 887-1086-1-ND